# Altium schematic sheet RFTX.SchDoc
size Legal; CompanyName: Brinton Engineering, LLC; Address1: 3479 Edison Way; Address2: Menlo Park CA 94025; Address3: +1 (877) 778-8435; Address4: brintonengineering.com; DocumentNumber: 49; Revision: 1; SheetNumber: 49; SheetTotal: 50
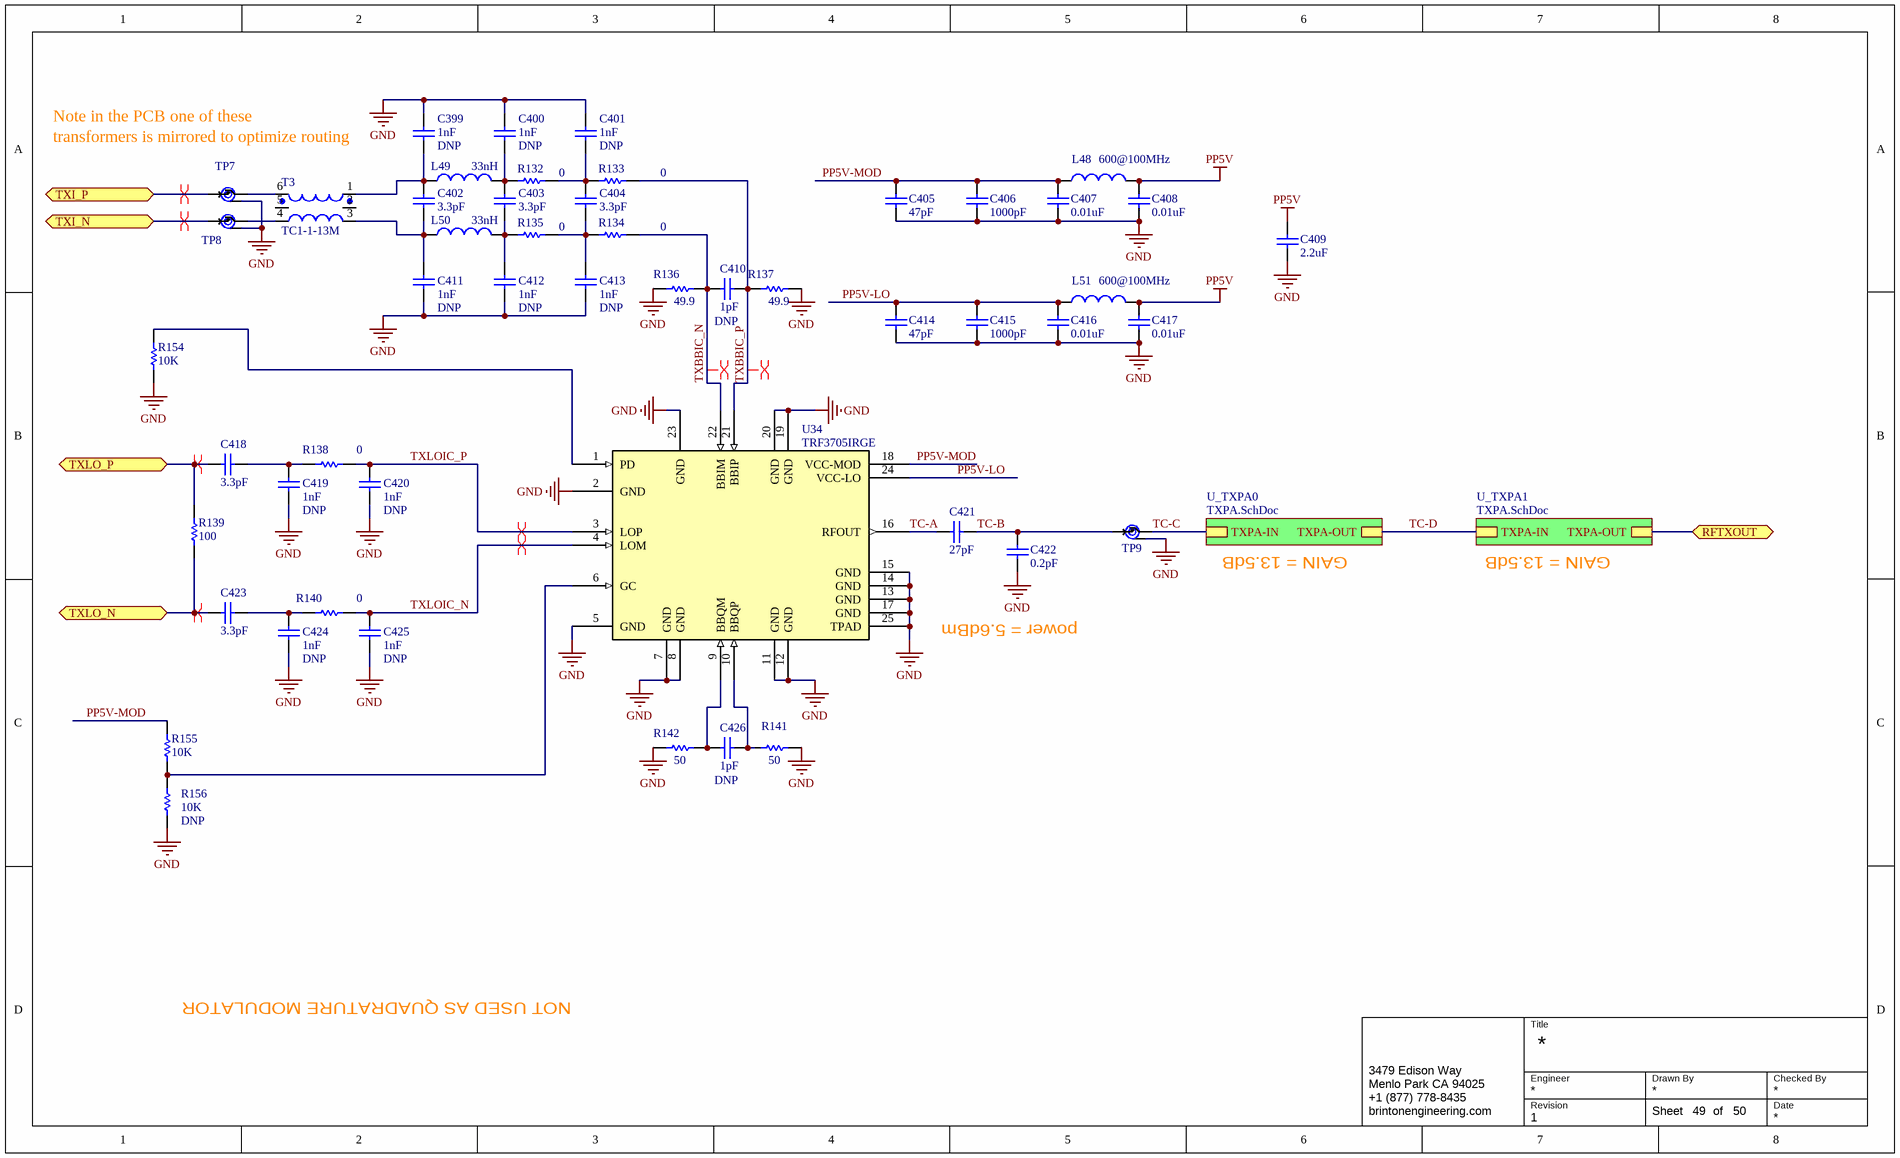
[diagram p0: RFTX.SchDoc]

## Parts
C399  value 1nF  Do Not Populate: DNP  [0402]  (hidden comment: CAP 0402)
C400  value 1nF  Do Not Populate: DNP  [0402]  (hidden comment: CAP 0402)
C401  value 1nF  Do Not Populate: DNP  [0402]  (hidden comment: CAP 0402)
C402  value 3.3pF  [0402]  (hidden comment: CAP 0402)
C403  value 3.3pF  [0402]  (hidden comment: CAP 0402)
C404  value 3.3pF  [0402]  (hidden comment: CAP 0402)
C405  value 47pF  [0402]  (hidden comment: CAP 0402)
C406  value 1000pF  [0402]  (hidden comment: CAP 0402)
C407  value 0.01uF  [0402]  (hidden comment: CAP 0402)
C408  value 0.01uF  [0402]  (hidden comment: CAP 0402)
C409  value 2.2uF  [1206]  (hidden comment: CAP 0402)
C410  value 1pF  Do Not Populate: DNP  [0402]  (hidden comment: CAP 0402)
C411  value 1nF  Do Not Populate: DNP  [0402]  (hidden comment: CAP 0402)
C412  value 1nF  Do Not Populate: DNP  [0402]  (hidden comment: CAP 0402)
C413  value 1nF  Do Not Populate: DNP  [0402]  (hidden comment: CAP 0402)
C414  value 47pF  [0402]  (hidden comment: CAP 0402)
C415  value 1000pF  [0402]  (hidden comment: CAP 0402)
C416  value 0.01uF  [0402]  (hidden comment: CAP 0402)
C417  value 0.01uF  [0402]  (hidden comment: CAP 0402)
C418  value 3.3pF  [0402]  (hidden comment: CAP 0402)
C419  value 1nF  Do Not Populate: DNP  [0402]  (hidden comment: CAP 0402)
C420  value 1nF  Do Not Populate: DNP  [0402]  (hidden comment: CAP 0402)
C421  value 27pF  [0402]  (hidden comment: CAP 0402)
C422  value 0.2pF  [0402]  (hidden comment: CAP 0402)
C423  value 3.3pF  [0402]  (hidden comment: CAP 0402)
C424  value 1nF  Do Not Populate: DNP  [0402]  (hidden comment: CAP 0402)
C425  value 1nF  Do Not Populate: DNP  [0402]  (hidden comment: CAP 0402)
C426  value 1pF  Do Not Populate: DNP  [0402]  (hidden comment: CAP 0402)
L48  value 600@100MHz  [0402]  (hidden comment: IND 0402)
L49  value 33nH  [0603]  (hidden comment: IND 0603)
L50  value 33nH  [0603]  (hidden comment: IND 0603)
L51  value 600@100MHz  [0402]  (hidden comment: IND 0402)
R132  value 0  [0402]  (hidden comment: RES 0402)
R133  value 0  [0402]  (hidden comment: RES 0402)
R134  value 0  [0402]  (hidden comment: RES 0402)
R135  value 0  [0402]  (hidden comment: RES 0402)
R136  value 49.9  [0402]  (hidden comment: RES 0402)
R137  value 49.9  [0402]  (hidden comment: RES 0402)
R138  value 0  [0402]  (hidden comment: RES 0402)
R139  value 100  [0402]  (hidden comment: RES 0402)
R140  value 0  [0402]  (hidden comment: RES 0402)
R141  value 50  [0402]  (hidden comment: RES 0402)
R142  value 50  [0402]  (hidden comment: RES 0402)
R154  value 10K  [0402]  (hidden comment: RES 0402)
R155  value 10K  [0402]  (hidden comment: RES 0402)
R156  value 10K  Do Not Populate: DNP  [0402]  (hidden comment: RES 0402)
T3  TC1-1-13M  [AT224-1A]
TP7  MS-180(20)  [MS-180(20)]  (value not drawn)
TP8  MS-180(20)  [MS-180(20)]  (value not drawn)
TP9  MS-180(20)  [MS-180(20)]  (value not drawn)
U34  Manufacturer P/N: TRF3705IRGE  [RGE-VQFN-24]  (hidden comment: TRF3705_RGE_24)

## Sub-sheets
U_TXPA0 = TXPA.SchDoc: TXPA-OUT, TXPA-IN
U_TXPA1 = TXPA.SchDoc: TXPA-OUT, TXPA-IN

## Ports
RFTXOUT, TXI_N, TXI_P, TXLO_N, TXLO_P

## Nets
GND: C399.1 C400.1 C401.1 C405.1 C406.1 C407.1 C408.1 C409.1 C411.1 C412.1 C413.1 C414.1 C415.1 C416.1 C417.1 C419.1 C420.1 C422.1 C424.1 C425.1 R136.2 R137.1 R141.1 R142.2 R154.2 R156.2 TP7.G(GND) TP8.G(GND) TP9.G(GND) U34.2(GND) U34.5(GND) U34.7(GND) U34.8(GND) U34.11(GND) U34.12(GND) U34.13(GND) U34.14(GND) U34.15(GND) U34.17(GND) U34.19(GND) U34.20(GND) U34.23(GND) U34.25(TPAD)
PP5V: C408.2 C409.2 C417.2 L48.1 L51.1
PP5V-LO: C414.2 C415.2 C416.2 L51.2 U34.24(VCC-LO)
PP5V-MOD: C405.2 C406.2 C407.2 L48.2 R155.1 U34.18(VCC-MOD)
RFTXOUT: port RFTXOUT, sheet U_TXPA1/TXPA-OUT
TC-A: C421.1 U34.16(RFOUT)
TC-B: C421.2 C422.2 TP9.C(IN)
TC-C: TP9.A(OUT) ; sheet U_TXPA0/TXPA-IN
TC-D: sheet U_TXPA0/TXPA-OUT, sheet U_TXPA1/TXPA-IN
TXBBIC_N: C410.1 R134.2 R136.1 U34.22(BBIM)
TXBBIC_P: C410.2 R133.2 R137.2 U34.21(BBIP)
TXI_N: TP8.C(IN) ; port TXI_N
TXI_P: TP7.C(IN) ; port TXI_P
TXLO_N: C423.2 R139.1 ; port TXLO_N
TXLO_P: C418.2 R139.2 ; port TXLO_P
TXLOIC_N: C425.2 R140.2 U34.4(LOM)
TXLOIC_P: C420.2 R138.2 U34.3(LOP)
NetC399_2: C399.2 C402.2 L49.1 T3.1
NetC400_2: C400.2 C403.2 L49.2 R132.1
NetC401_2: C401.2 C404.2 R132.2 R133.1
NetC402_1: C402.1 C411.2 L50.1 T3.3
NetC403_1: C403.1 C412.2 L50.2 R135.1
NetC404_1: C404.1 C413.2 R134.1 R135.2
NetC418_1: C418.1 C419.2 R138.1
NetC423_1: C423.1 C424.2 R140.1
NetC426_1: C426.1 R142.1 U34.9(BBQM)
NetC426_2: C426.2 R141.2 U34.10(BBQP)
NetR154_1: R154.1 U34.1(PD)
NetR155_2: R155.2 R156.1 U34.6(GC)
NetT3_4: T3.4 TP8.A(OUT)
NetT3_6: T3.6 TP7.A(OUT)

Not connected (* = marked no-connect by the designer): T3 2 5

## Layout directives
differential pair: TXBBIC_N, TXBBIC_P, TXI_N, TXI_P, TXLO_N, TXLO_P, TXLOIC_N, TXLOIC_P

## Notes on the sheet
- Note in the PCB one of these
- (near C399) transformers is mirrored to optimize routing
- GAIN = 13.5dB
- power = 5.6dBm
- NOT USED AS QUADRATURE MODULATOR
- Title
- Engineer
- Revision
- Drawn By
- Checked By
- Date
- Sheet
- of

## Library data of the parts
C399-C401 C410-C413 C419 C420 C422 C424-C426 = CAP 0402: Voltage: 16V; Manufacturer: *; Manufacturer P/N: *; PCB Package: 0402
C402-C404 C418 C423 = CAP 0402: Manufacturer: Johanson Technology; Manufacturer P/N: 500R07S3R3BV4T; Voltage: 50V; Q@900MHz: 400; PCB Package: 0402
C405 C414 = CAP 0402: Manufacturer: Kemet; Manufacturer P/N: CBR04C470F3GAC; Voltage: 25V; PCB Package: 0402
C406 C415 = CAP 0402: Manufacturer: Murata; Manufacturer P/N: GRM155R71H102KA01D; Voltage: 50V; PCB Package: 0402
C407 C408 C416 C417 = CAP 0402: Manufacturer: Murata; Manufacturer P/N: GRM155R71E103KA01D; Voltage: 25V; PCB Package: 0402
C409 = CAP 0402: Manufacturer: Kemet; Manufacturer P/N: T491A225K010AT; Voltage: 16V; PCB Package: 1206
C421 = CAP 0402: Manufacturer: American Technical Ceramics; Manufacturer P/N: 600L270JT200T; Voltage: 200V; Q@900MHz: 2000; PCB Package: 0402
L48 L51 = IND 0402: Inductor; Manufacturer: Murata; Manufacturer P/N: BLM15PX601SN1D; PCB Package: 0402
L49 L50 = IND 0603: Inductor; Manufacturer: Murata; Manufacturer P/N: LQW18AN33NJ00D; Q@75MHz: 25; PCB Package: 0603
R132-R135 R138-R142 R154-R156 = RES 0402: Resistor, SMD 0402; PCB Package: 0402; Manufacturer: *; Manufacturer P/N: *
  R132-R135: Do Not Place: *
R136 R137 = RES 0402: Resistor, SMD 0402; Manufacturer: Panasonic; Manufacturer P/N: ERJ-2RKF49R9X; PCB Package: 0402
T3 = TC1-1-13M: RF Transformer 4-3000KHz 50 ohms; Manufacturer: Mini-Circuits; Manufacturer P/N: TC1-1-13M
TP7-TP9 = MS-180(20): Coaxial Connector Switch; Manufacturer: Hirose; Manufacturer P/N: MS-180(20)
U34 = TRF3705_RGE_24: 300MHz to 4GHz Quadrature Modulator; Vendor: Texas Instruments; PACKAGE_DESIGNATOR: RGE; PIN_COUNT: 24; FAMILY_NAME: IQ MODULATOR; INDUSTRY_STD_PKG_TYPE: VQFN; GENERIC_PART_NUMBER: TRF3705; Datasheet URL: http://www.ti.com/lit/gpn/TRF3705; Manufacturer: Texas Instruments; RefDes: RefDes; Type: DEV; Value: Value